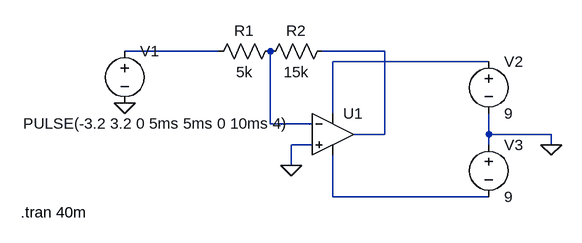
[diagram p0: schematic week2_20b.asc]
week2_20b.asc, the LTspice schematic file:
Version 4
SHEET 1 880 680
WIRE 48 80 -96 80
WIRE 304 80 208 80
WIRE 464 96 224 96
WIRE 224 176 224 96
WIRE 128 192 128 80
WIRE 192 192 128 192
WIRE 304 208 304 80
WIRE 304 208 256 208
WIRE 464 208 464 176
WIRE 560 208 464 208
WIRE 192 224 160 224
WIRE 464 224 464 208
WIRE 560 224 560 208
WIRE 160 256 160 224
WIRE 224 304 224 240
WIRE 464 304 224 304
FLAG -96 160 0
FLAG 560 224 0
FLAG 160 256 0
SYMBOL res 144 64 R90
WINDOW 0 0 56 VBottom 2
WINDOW 3 32 56 VTop 2
SYMATTR InstName R1
SYMATTR Value 5k
SYMBOL res 224 64 R90
WINDOW 0 0 56 VBottom 2
WINDOW 3 32 56 VTop 2
SYMATTR InstName R2
SYMATTR Value 15k
SYMBOL voltage -96 64 R0
WINDOW 3 -156 127 Left 2
WINDOW 123 0 0 Left 0
WINDOW 39 0 0 Left 0
SYMATTR Value PULSE(-3.2 3.2 0 5ms 5ms 0 10ms 4)
SYMATTR InstName V1
SYMBOL voltage 464 80 R0
WINDOW 123 0 0 Left 0
WINDOW 39 0 0 Left 0
SYMATTR InstName V2
SYMATTR Value 9
SYMBOL voltage 464 208 R0
WINDOW 123 0 0 Left 0
WINDOW 39 0 0 Left 0
SYMATTR InstName V3
SYMATTR Value 9
SYMBOL OpAmps\\UniversalOpamp2 224 208 R0
SYMATTR InstName U1
TEXT -256 328 Left 2 !.tran 40m

The netlist it stands for:
* week2_20b.asc
R1 N004 N001 5k
R2 N002 N004 15k
V1 N001 0 PULSE(-3.2 3.2 0 5ms 5ms 0 10ms 4)
V2 N003 0 9
V3 0 N005 9
XU1 0 N004 N003 N005 N002 level.2 Avol=1Meg GBW=10Meg Slew=10Meg ilimit=25m rail=0 Vos=0 phimargin=45 en=0 enk=0 in=0 ink=0 Rin=500Meg  ; pins IN+ IN- V+ V- OUT
.tran 40m
.lib UniversalOpamps2.sub
.backanno
.end